# Altium schematic sheet PERSEUS_Halbbruecke.SchDoc
size A4; SheetNumber: 2; SheetTotal: 4
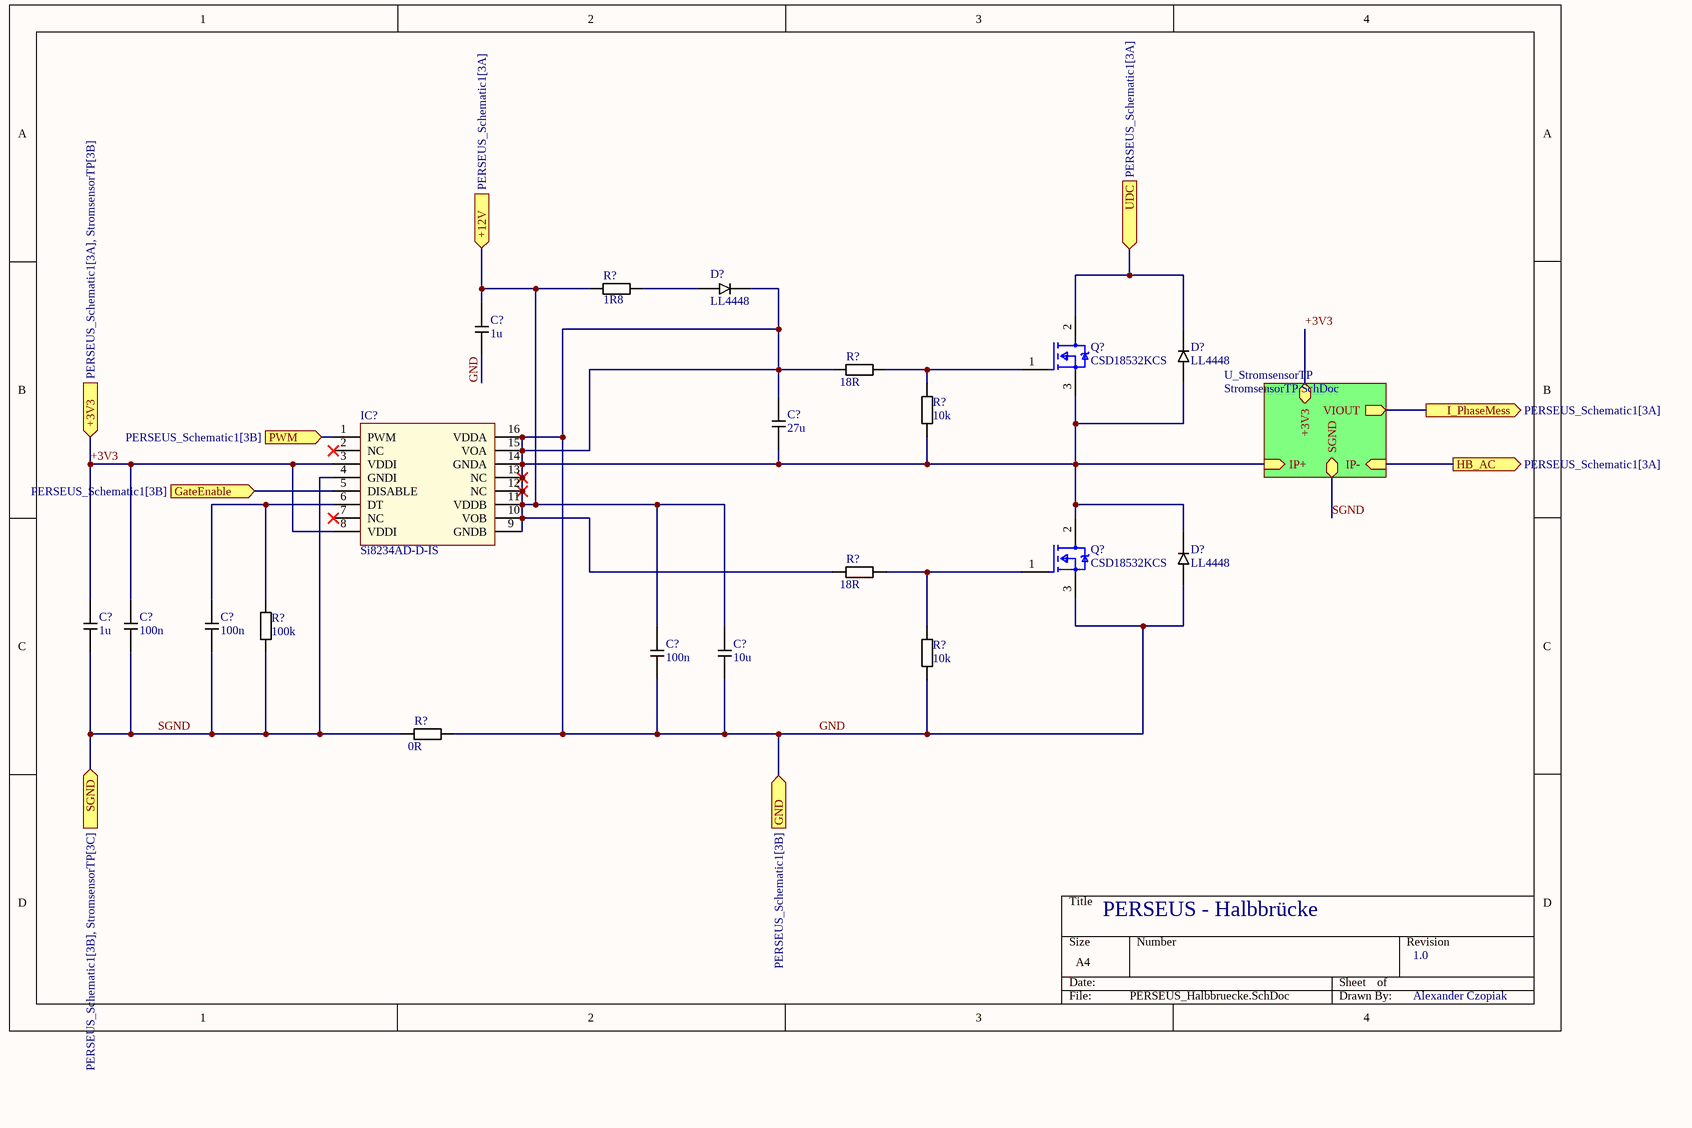
[diagram p0: PERSEUS_Halbbruecke.SchDoc]

## Parts
(Parts that share a designator on the sheet are numbered #1, #2 ... from top to bottom, then left to right.)
C?#1  1u  [1206_C]
C?#2  27u  [1206_C]
C?#3  1u  [1206_C]
C?#4  100n  [1206_C]
C?#5  100n  [1206_C]
C?#6  100n  [1206_C]
C?#7  10u  [1206_C]
D?#1  LL4448  [MINIMELF-SOD80]
D?#2  LL4448  [MINIMELF-SOD80]
D?#3  LL4448  [MINIMELF-SOD80]
IC?  Si8234AD-D-IS  [SO16_W]
Q?#1  CSD18532KCS  [FP-PG-TO220-3-MFG]
Q?#2  CSD18532KCS  [FP-PG-TO220-3-MFG]
R?#1  1R8  [1206_R]
R?#2  18R  [1206_R]
R?#3  10k  [1206_R]
R?#4  18R  [1206_R]
R?#5  100k  [1206_R]
R?#6  10k  [1206_R]
R?#7  0R  [1206_R]

## Sub-sheets
U_StromsensorTP = StromsensorTP.SchDoc: SGND (bidir), +3V3 (bidir), IP+ (in), IP- (in), VIOUT (out)

## Ports
+3V3 (in, see PERSEUS_Schematic1[3A], StromsensorTP[3B]), +12V (in, see PERSEUS_Schematic1[3A]), GateEnable (in, see PERSEUS_Schematic1[3B]), GND (in, see PERSEUS_Schematic1[3B]), HB_AC (out, see PERSEUS_Schematic1[3A]), I_PhaseMess (out, see PERSEUS_Schematic1[3A]), PWM (in, see PERSEUS_Schematic1[3B]), SGND (in, see PERSEUS_Schematic1[3B], StromsensorTP[3C]), UDC (in, see PERSEUS_Schematic1[3A])

## Nets
+3V3: C?#3.2 C?#4.2 IC?.3(VDDI) IC?.8(VDDI) ; port +3V3, sheet U_StromsensorTP/+3V3
GateEnable: IC?.5(DISABLE) ; port GateEnable
GND: C?#1.1 C?#1.2 C?#2.1 C?#2.2 C?#6.1 C?#6.2 C?#7.1 C?#7.2 D?#1.2(K) D?#2.1(A) D?#3.1(A) D?#3.2(K) IC?.9(GNDB) IC?.10(VOB) IC?.11(VDDB) IC?.12(NC) IC?.13(NC) IC?.14(GNDA) IC?.15(VOA) IC?.16(VDDA) Q?#1.3(SOURCE) Q?#2.2(DRAIN) Q?#2.3(SOURCE) R?#1.1 R?#2.1 R?#3.2 R?#4.1 R?#6.1 R?#7.2 ; port +12V, port GND, sheet U_StromsensorTP/IP+
HB_AC: port HB_AC, sheet U_StromsensorTP/IP-
I_PhaseMess: port I_PhaseMess, sheet U_StromsensorTP/VIOUT
PWM: IC?.1(PWM) ; port PWM
SGND: C?#3.1 C?#4.1 C?#5.1 IC?.4(GNDI) R?#5.1 R?#7.1 ; port SGND, sheet U_StromsensorTP/SGND
UDC: D?#2.2(K) Q?#1.2(DRAIN) ; port UDC
NetC?#5_2: C?#5.2 IC?.6(DT) R?#5.2
NetD?#1_1: D?#1.1(A) R?#1.2
NetQ?#1_1: Q?#1.1(GATE) R?#2.2 R?#3.1
NetQ?#2_1: Q?#2.1(GATE) R?#4.2 R?#6.2

Not connected (* = marked no-connect by the designer): IC? 2(NC)* 7(NC)*

## Notes on the sheet
- PERSEUS - Halbbrücke
- 1.0
- Alexander Czopiak

## Library data of the parts
C?#1-C?#7 = CAP: Kondensator (ohne Polarität)
D?#1-D?#3 = DIODE: Diode (z.B. 1N4448)
IC? = Si8234AD-D-IS: Gate-Treiber 5 kV 5 V UVLO HS/LS isolated gate driver with PWM input, deadtime with external resistor; EBS_Nummer: 8717; HelpURL: https://ebs.eti.kit.edu/Artikel/Detailansicht/8717
Q?#1 Q?#2 = CMP-32901-001154-1: MOSFET N-CH 60V 100A TO220; Polarization: N; Power Dissipation: 115W; Rds On Max: 16.5mR; Gate to Source Voltage (Vgs): 20V; Continuous Drain Current (ID): 55A; Threshold Voltage: 4V; Turn-On Delay Time: 13ns; Element Configuration: Single; Input Capacitance: 1.812nF; Turn-Off Delay Time: 40ns; Mount: Through Hole; Drain to Source Voltage (Vdss): 60V; Max Dual Supply Voltage: 60V; Length: 0.42inch; Height: 0.65inch; Width: 0.19inch; Packaging: Rail/Tube; Halogen Free: Halogen Free; Number of Pins: 3; Drain to Source Resistance: 16.5mR; Series: HEXFET®; RoHS Compliant: Yes; Reach SVHC Compliant: Yes; Drain to Source Breakdown Voltage: 60V; Max Operating Temperature: 175°C; Case/Package: TO-220; Max Power Dissipation: 115W; Lead Free: Lead Free; Min Operating Temperature: -55°C
R?#1-R?#7 = WIDERSTAND